# Altium project R20_PCBM.PrjPcb
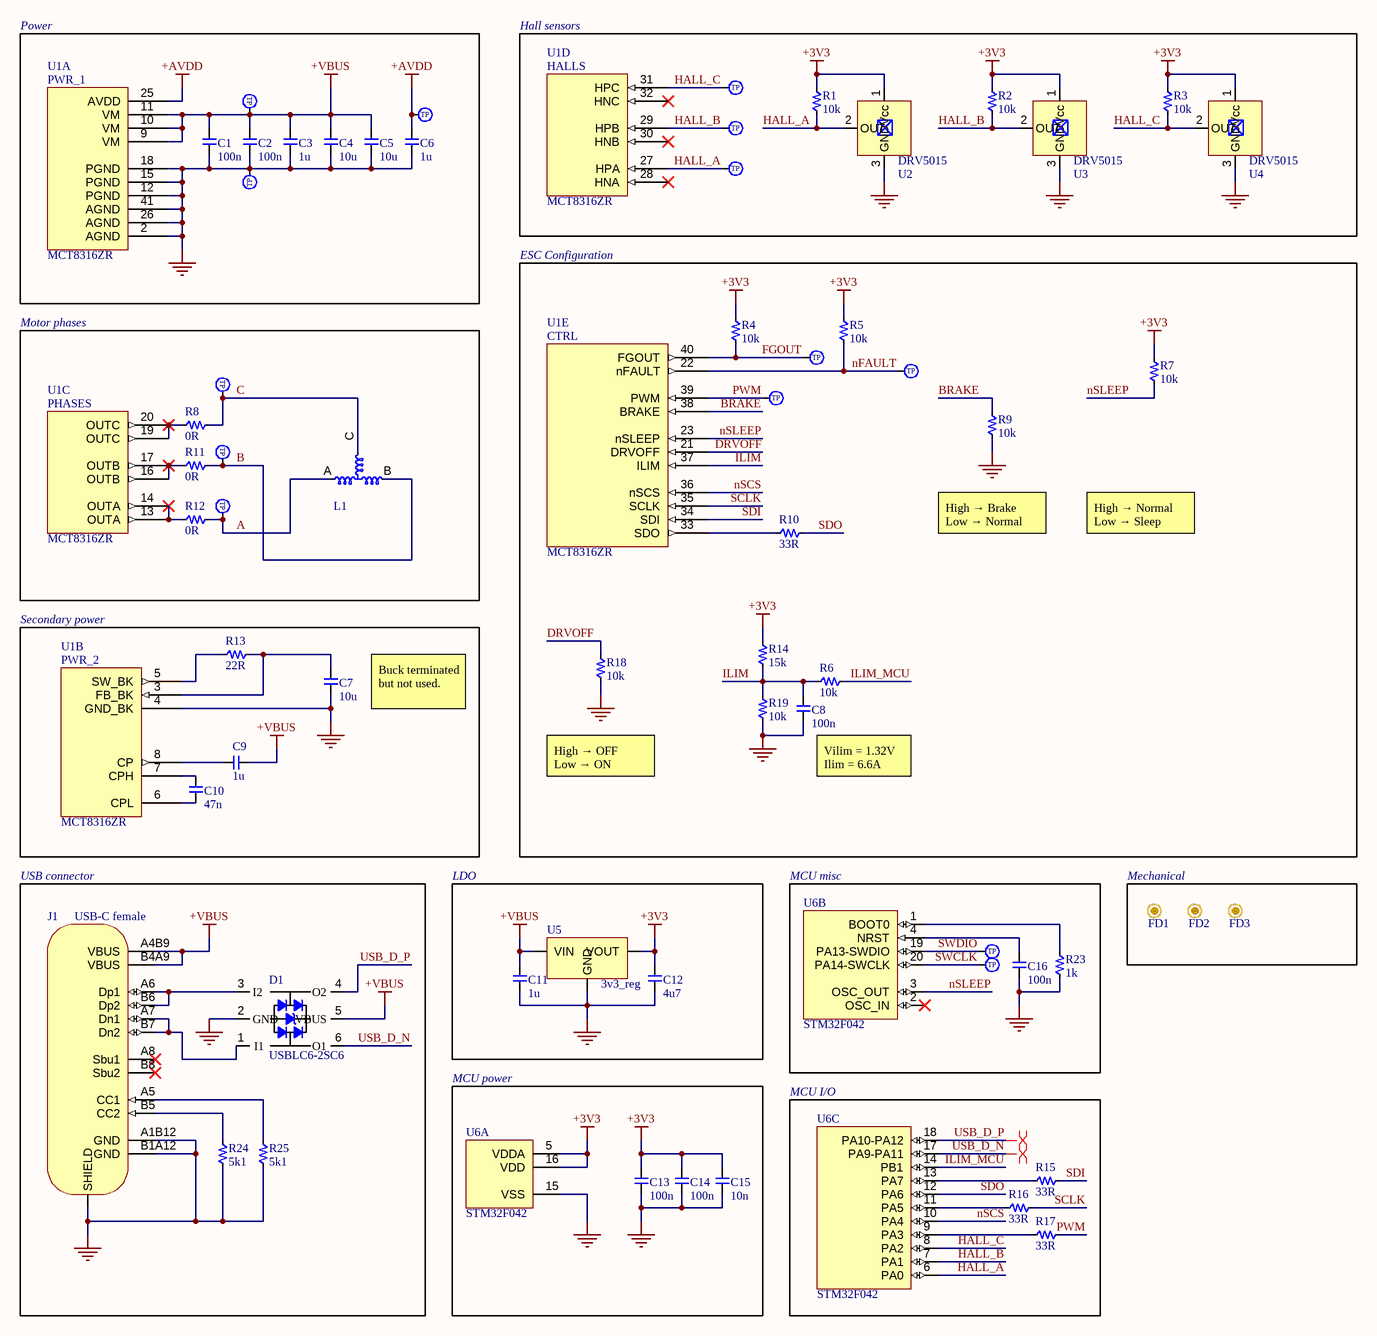
[diagram p0: R20_PCBM.SchDoc]
PCB_Revision: R20_PCBM_v1.0; Project: PCBM; Project_revision: PCBM 1.0
1 sheet, 64 parts. Net scope: global (net labels, ports and power ports of the same name join across sheets).
Board file: R20_PCBM.PcbDoc

## Sheet R20_PCBM.SchDoc
size A3; SheetNumber: 1; SheetTotal: 1

### Parts
C1  100n  [C0402]
C2  100n  [C0402]
C3  1u  [C0603]
C4  10u  [C0805]
C5  10u  [C0805]
C6  1u  [C0402]
C7  10u  [C0805]
C8  100n  [C0402]
C9  1u  [C0402]
C10  47n  [C0603]
C11  1u  [C0402]
C12  4u7  [C0402]
C13  100n  [C0402]
C14  100n  [C0402]
C15  10n  [C0402]
C16  100n  [C0402]
D1  USBLC6-2SC6  [USBLC6-2SC6]
FD1  Fiducial  [Fiducial]  (value not drawn)  (no BOM)
FD2  Fiducial  [Fiducial]  (value not drawn)  (no BOM)
FD3  Fiducial  [Fiducial]  (value not drawn)  (no BOM)
J1  USB-C female  [TYPE-C-31-M-12]
L1  L_phase  [R20_PCBM_4]  (value not drawn)  (no BOM)
R1  10k  [R0402]
R2  10k  [R0402]
R3  10k  [R0402]
R4  10k  [R0402]
R5  10k  [R0402]
R6  10k  [R0402]
R7  10k  [R0402]
R8  0R  [R0402]
R9  10k  [R0402]
R10  33R  [R0402]
R11  0R  [R0402]
R12  0R  [R0402]
R13  22R  [R0402]
R14  15k  [R0402]
R15  33R  [R0402]
R16  33R  [R0402]
R17  33R  [R0402]
R18  10k  [R0402]
R19  10k  [R0402]
R23  1k  [R0402]
R24  5k1  [R0402]
R25  5k1  [R0402]
TP1  Testing_Point_1mm  [TestingPoint_1mm]  (value not drawn)  (no BOM)
TP2  Testing_Point_1mm  [TestingPoint_1mm]  (value not drawn)  (no BOM)
TP3  Testing_Point_1mm  [TestingPoint_1mm]  (value not drawn)  (no BOM)
TP4  Testing_Point_1mm  [TestingPoint_1mm]  (value not drawn)  (no BOM)
TP5  Testing_Point_1mm  [TestingPoint_1mm]  (value not drawn)  (no BOM)
TP6  Testing_Point_1mm  [TestingPoint_1mm]  (value not drawn)  (no BOM)
TP7  Testing_Point_1mm  [TestingPoint_1mm]  (value not drawn)  (no BOM)
TP8  Testing_Point_1mm  [TestingPoint_1mm]  (value not drawn)  (no BOM)
TP9  Testing_Point_1mm  [TestingPoint_1mm]  (value not drawn)  (no BOM)
TP10  Testing_Point_1mm  [TestingPoint_1mm]  (value not drawn)  (no BOM)
TP11  Testing_Point_1mm  [TestingPoint_1mm]  (value not drawn)  (no BOM)
TP12  Testing_Point_1mm  [TestingPoint_1mm]  (value not drawn)  (no BOM)
TP15  Testing_Point_1mm  [TestingPoint_1mm]  (value not drawn)  (no BOM)
TP16  Testing_Point_1mm  [TestingPoint_1mm]  (value not drawn)  (no BOM)
U1  MCT8316ZR  [QFN50P500X700X100_HS-41N]  (parts A,B,C,D,E of 5)
U2  DRV5015  [SOT95P237X112-3N]
U3  DRV5015  [SOT95P237X112-3N]
U4  DRV5015  [SOT95P237X112-3N]
U5  3v3_reg  [SOT23_torex]
U6  STM32F042  [TSSOP20_ST]  (parts A,B,C of 3)

### Blocks framed on the sheet
Power: C1-C6 TP2 TP3 TP6 U1
Hall sensors: R1-R3 TP1 TP4 TP5 U1-U4
ESC Configuration: C8 R4-R7 R9 R10 R14 R18 R19 TP7 TP8 TP10 U1
Motor phases: L1 R8 R11 R12 TP9 TP11 TP12 U1
Secondary power: C7 C9 C10 R13 U1
USB connector: D1 J1 R24 R25
LDO: C11 C12 U5
MCU misc: C16 R23 TP15 TP16 U6
Mechanical: FD1-FD3
MCU power: C13-C15 U6
MCU I/O: R15-R17 U6

### Nets
+3V3: C12.2 C13.2 C14.2 C15.2 R1.2 R2.2 R3.2 R4.2 R5.2 R7.2 R14.2 U2.1(Vcc) U3.1(Vcc) U4.1(Vcc) U5.2(VOUT) U6.5(VDDA) U6.16(VDD)
+AVDD: C6.2 TP3.1 U1.25(AVDD)
+VBUS: C1.2 C2.2 C3.2 C4.2 C5.2 C9.1 C11.2 D1.5(VBUS) J1.A4B9(VBUS) J1.B4A9(VBUS) TP2.1 U1.9(VM) U1.10(VM) U1.11(VM) U5.3(VIN)
GND: C1.1 C2.1 C3.1 C4.1 C5.1 C6.1 C7.1 C8.1 C11.1 C12.1 C13.1 C14.1 C15.1 C16.1 D1.2(GND) J1.A1B12(GND) J1.B1A12(GND) J1.M1(SHIELD) R9.1 R18.1 R19.1 R23.1 R24.1 R25.1 TP6.1 U1.2(AGND) U1.4(GND_BK) U1.12(PGND) U1.15(PGND) U1.18(PGND) U1.26(AGND) U1.41(AGND) U2.3(GND) U3.3(GND) U4.3(GND) U5.1(GND) U6.15(VSS)
A: L1.A R12.2 TP12.1
B: L1.B R11.2 TP11.1
BRAKE: R9.2 U1.38(BRAKE)
C: L1.C R8.2 TP9.1
DRVOFF: R18.2 U1.21(DRVOFF)
FGOUT: R4.1 TP7.1 U1.40(FGOUT)
HALL_A: R1.1 TP5.1 U1.27(HPA) U2.2(OUT) U6.6(PA0)
HALL_B: R2.1 TP4.1 U1.29(HPB) U3.2(OUT) U6.7(PA1)
HALL_C: R3.1 TP1.1 U1.31(HPC) U4.2(OUT) U6.8(PA2)
ILIM: C8.2 R6.1 R14.1 R19.2 U1.37(ILIM)
ILIM_MCU: R6.2 U6.14(PB1)
nFAULT: R5.1 TP8.1 U1.22(nFAULT)
nSCS: U1.36(nSCS) U6.10(PA4)
nSLEEP: R7.1 U1.23(nSLEEP) U6.3(OSC_OUT)
PWM: R17.2 TP10.1 U1.39(PWM)
SCLK: R16.2 U1.35(SCLK)
SDI: R15.2 U1.34(SDI)
SDO: R10.2 U6.12(PA6)
SWCLK: TP16.1 U6.20(PA14-SWCLK)
SWDIO: TP15.1 U6.19(PA13-SWDIO)
USB_D_N: D1.6(O1) U6.17(PA9-PA11)
USB_D_P: D1.4(O2) U6.18(PA10-PA12)
NetC7_2: C7.2 R13.2 U1.3(FB_BK)
NetC9_2: C9.2 U1.8(CP)
NetC10_1: C10.1 U1.6(CPL)
NetC10_2: C10.2 U1.7(CPH)
NetC16_2: C16.2 U6.4(NRST)
NetD1_1: D1.1(I1) J1.A7(Dn1) J1.B7(Dn2)
NetD1_3: D1.3(I2) J1.A6(Dp1) J1.B6(Dp2)
NetJ1_A5: J1.A5(CC1) R25.2
NetJ1_B5: J1.B5(CC2) R24.2
NetR8_1: R8.1 U1.19(OUTC) U1.20(OUTC)
NetR10_1: R10.1 U1.33(SDO)
NetR11_1: R11.1 U1.16(OUTB) U1.17(OUTB)
NetR12_1: R12.1 U1.13(OUTA) U1.14(OUTA)
NetR13_1: R13.1 U1.5(SW_BK)
NetR15_1: R15.1 U6.13(PA7)
NetR16_1: R16.1 U6.11(PA5)
NetR17_1: R17.1 U6.9(PA3)
NetR23_2: R23.2 U6.1(BOOT0)

Not connected (* = marked no-connect by the designer): J1 A8(Sbu1)* B8(Sbu2)*; U1 28(HNA)* 30(HNB)* 32(HNC)*; U6 2(OSC_IN)*

### Layout directives
differential pair: USB_D_N, USB_D_P

### Notes on the sheet
- High → Brake
  Low → Normal
- High → Normal
  Low → Sleep
- (near C7) Buck terminated but not used.
- High → OFF
  Low → ON
- (near C8) Vilim = 1.32V
  Ilim = 6.6A
- PROJECT
- PCB Revision:
- SIZE
- FILE NAME
- SHEET
- Guim Pedrero
  Electronics Design Engineer
- DATE
- A3
- (in symbol MCT8316ZR, part A) PWR_1
- (in symbol MCT8316ZR, part B) PWR_2
- (in symbol MCT8316ZR, part C) PHASES
- (in symbol MCT8316ZR, part D) HALLS
- (in symbol MCT8316ZR, part E) CTRL
- (in symbol Testing_Point_1mm) TP

### Library data of the parts
C1 C2 C8 = C_0402: 0402 cap; Voltage: 50V; Rating: X7R; LCSC: C307331
C3 = C_0603: 0603 cap; Voltage: 50V; Rating: X5R; LCSC: C15849
C4 C5 C7 = C_0805: 0805 cap; Voltage: 50V; Rating: X5R; LCSC: C440198
C6 C9 = C_0402: 0402 cap; Voltage: 25V; Rating: X5R; LCSC: C52923
C10 = C_0603: 0603 cap; Voltage: 50V; Rating: X7R; LCSC: C1622
C11-C16 = C_0402: 0402 cap
  C11: LCSC: C52923
  C12: LCSC: C23733
  C13 C14 C16: LCSC: C1525
  C15: LCSC: C15195
D1 = USBLC6-2SC6: Trans Voltage Suppressor Diode, 5V V(RWM), Unidirectional, 1 Element, Silicon; Manufacturer: STMicroelectronics; Package Body Material: Plastic; Additional Feature: HIGH RELIABILITY; Min Breakdown Voltage: 6V; Number of Elements: 1; Clamping Voltage-Max: 17V; Reference Standard: IEC-61000-4-2; Qualification Status: Not Qualified; Supplier 1: Mouser; Manufacturer Part Number: USBLC6-2SC6; RoHS: Yes; Category: TVS Diodes; Stock 1: 162692; Pricing 1: 1=0.61, 10=0.522, 50=0.522, 100=0.375, 1000=0.258, 10000=0.204 (USD); Pins: 6; Package Shape: Rectangular; Terminal Finish: Tin; Diode Element Material: SILICON; Min Operating Temperature: -40°C; Max Operating Temperature: 125°C; JESD-609 Code: e3; Polarity: Unidirectional; Package Style: SMALL OUTLINEMeter; Diode Type: TRANS VOLTAGE SUPPRESSOR; JESD-30 Code: R-PDSO-G6; Moisture Sensitivity Level: 1; Rep Pk Reverse Voltage-Max: 5V; Surface Mount: Yes; Technology: AVALANCHE; Terminal Form: Gull Wing; Terminal Position: DUAL; Peak Reflow Temperature (Cel): 260°C; Reach SVHC Compliant: Yes; RoHS Compliant: Yes; ComponentLink1URL: https://datasheet.ciiva.com:443/pdfs/VipMasterIC/IC/SGST/SGSTS30336/SGSTS30336-1.pdf?src-supplier=IHS+Markit; ComponentLink1Description: https://datasheet.ciiva.com:443/pdfs/VipMasterIC/IC/SGST/SGSTS30336/SGSTS30336-1.pdf?src-supplier=IHS+Markit; ComponentLink2URL: https://datasheet.ciiva.com/1268/1690354-1268384.pdf?src-supplier=Element14; ComponentLink2Description: https://datasheet.ciiva.com/1268/1690354-1268384.pdf?src-supplier=Element14; ComponentLink3URL: https://datasheet.ciiva.com/4508/cd00050750-113117-4508433.pdf?src-supplier=Mouser; ComponentLink3Description: https://datasheet.ciiva.com/4508/cd00050750-113117-4508433.pdf?src-supplier=Mouser; ComponentLink4URL: https://datasheet.ciiva.com/15143/getdatasheetpartid-148465-15143789.pdf?src-supplier=Verical; ComponentLink4Description: https://datasheet.ciiva.com/15143/getdatasheetpartid-148465-15143789.pdf?src-supplier=Verical; ComponentLink5URL: https://datasheet.ciiva.com/16200/cd00050750-16200026.pdf?src-supplier=Future+Electronics; ComponentLink5Description: https://datasheet.ciiva.com/16200/cd00050750-16200026.pdf?src-supplier=Future+Electronics; ComponentLink6URL: https://datasheet.ciiva.com/41444/001184109-da-01-en-ic-esd-protecti-usblc6-2sc6-sot-23-6-stm-41444156.pdf?src-supplier=Conrad; ComponentLink6Description: https://datasheet.ciiva.com/41444/001184109-da-01-en-ic-esd-protecti-usblc6-2sc6-sot-23-6-stm-41444156.pdf?src-supplier=Conrad; Supplier Part Number 1: 511-USBLC6-2SC6; LCSC: C2827654
J1 = TYPE-C-31-M-12: Conn USB Type C PL 22 POS 0.5mm Solder ST SMD 22 Terminal 1Port Emboss T/R; Manufacturer: HRO Electronics; Supplier 1: LCSC; Manufacturer Part Number: TYPE-C-31-M-12; RoHS: No; Category: Uncategorized; Stock 1: 6920; Pricing 1: 5=0.1612, 50=0.1282, 150=0.112, 1000=0.0977, 2000=0.0937, 5000=0.0913 (USD); Supplier Part Number 1: C165948; LCSC: C165948
L1 = L_3phase
R1-R19 R23-R25 = R_0402: 0402 62.5mW
  R1-R7 R9 R18 R19: LCSC: C25744
  R8 R11 R12: LCSC: C17168
  R10 R15-R17: LCSC: C25105
  R13: LCSC: C25092
  R14: LCSC: C25756
  R23: LCSC: C11702
  R24 R25: LCSC: C25905
TP1-TP12 TP15 TP16 = Testing_Point_1mm: 1mm testing point
U1 = MCT8316ZR: 40-V max, 8-A peak, sensored trapezoidal control 3-phase BLDC motor driver 40-VQFN -40 to 125; Manufacturer: Texas Instruments; Manufacturer Part Number: MCT8316Z0TRGFR; Supplier: Mouser; Supplier Part Number: 595-MCT8316Z0TRGFR; RoHS: No; Category: Integrated Circuits (ICs); Stock: 5280; Pricing: 1=3.66, 10=3.22, 50=3.22, 100=2.69, 1000=1.94, 10000=1.83 (USD); LCSC: C3681397
U2-U4 = DRV5015: Hall Effect Sensor, -3.7mT Min, 3.7mT Max, 0-20mA, Plastic/epoxy, Rectangular, Surface Mount; Manufacturer: Texas Instruments; Manufacturer Part Number: DRV5015A3QDBZR; Sensor Type: MAGNETIC FIELD SENSOR,HALL EFFECT; Supplier: Mouser; Supplier Part Number: 595-DRV5015A3QDBZR; RoHS: Yes; Category: Integrated Circuits (ICs); Stock: 7485; Pricing: 1=0.25, 10=0.175, 50=0.175, 100=0.154, 1000=0.124, 10000=0.123 (USD); Terminal Finish: Tin; JESD-609 Code: e3; Reach SVHC Compliant: Yes; RoHS Compliant: Yes; ComponentLink1URL: https://www.ti.com:443/lit/ds/symlink/drv5015.pdf?src-supplier=IHS+Markit; ComponentLink1Description: https://www.ti.com:443/lit/ds/symlink/drv5015.pdf?src-supplier=IHS+Markit; ComponentLink2URL: http://www.ti.com/general/docs/suppproductinfo.tsp?distId=10&amp;gotoUrl=http%3A%2F%2Fwww.ti.com%2Flit%2Fgpn%2Fdrv5015&src-supplier=Digikey; ComponentLink2Description: http://www.ti.com/general/docs/suppproductinfo.tsp?distId=10&amp;gotoUrl=http%3A%2F%2Fwww.ti.com%2Flit%2Fgpn%2Fdrv5015&src-supplier=Digikey; LCSC: C2152442
U5 = XC6206P332MR-G: 200mA Fixed 3.3V Positive electrode 6V SOT-23-3L Voltage Regulators - Linear, Low Drop Out (LDO) Regulators ROHS; LCSC: C5446
U6 = STM32F042F6P6TR: 32KB 1.65V~3.6V ARM-M0 48MHz 16 TSSOP-20(4.4x6.5) Microcontrollers (MCU/MPU/SOC) ROHS; LCSC: C2969989